# Altium schematic sheet Main Diagram.SchDoc: Main Diagram
size Letter; Author: Alfredo Cortellini; Organization: IT Logic; Address1: 5753 Highway 85 N; Address2: Crestview, FL 32536; Address3: United States; DocumentNumber: 3; SheetNumber: 3; SheetTotal: 3; Email: pcb-design@itlogic.cloud
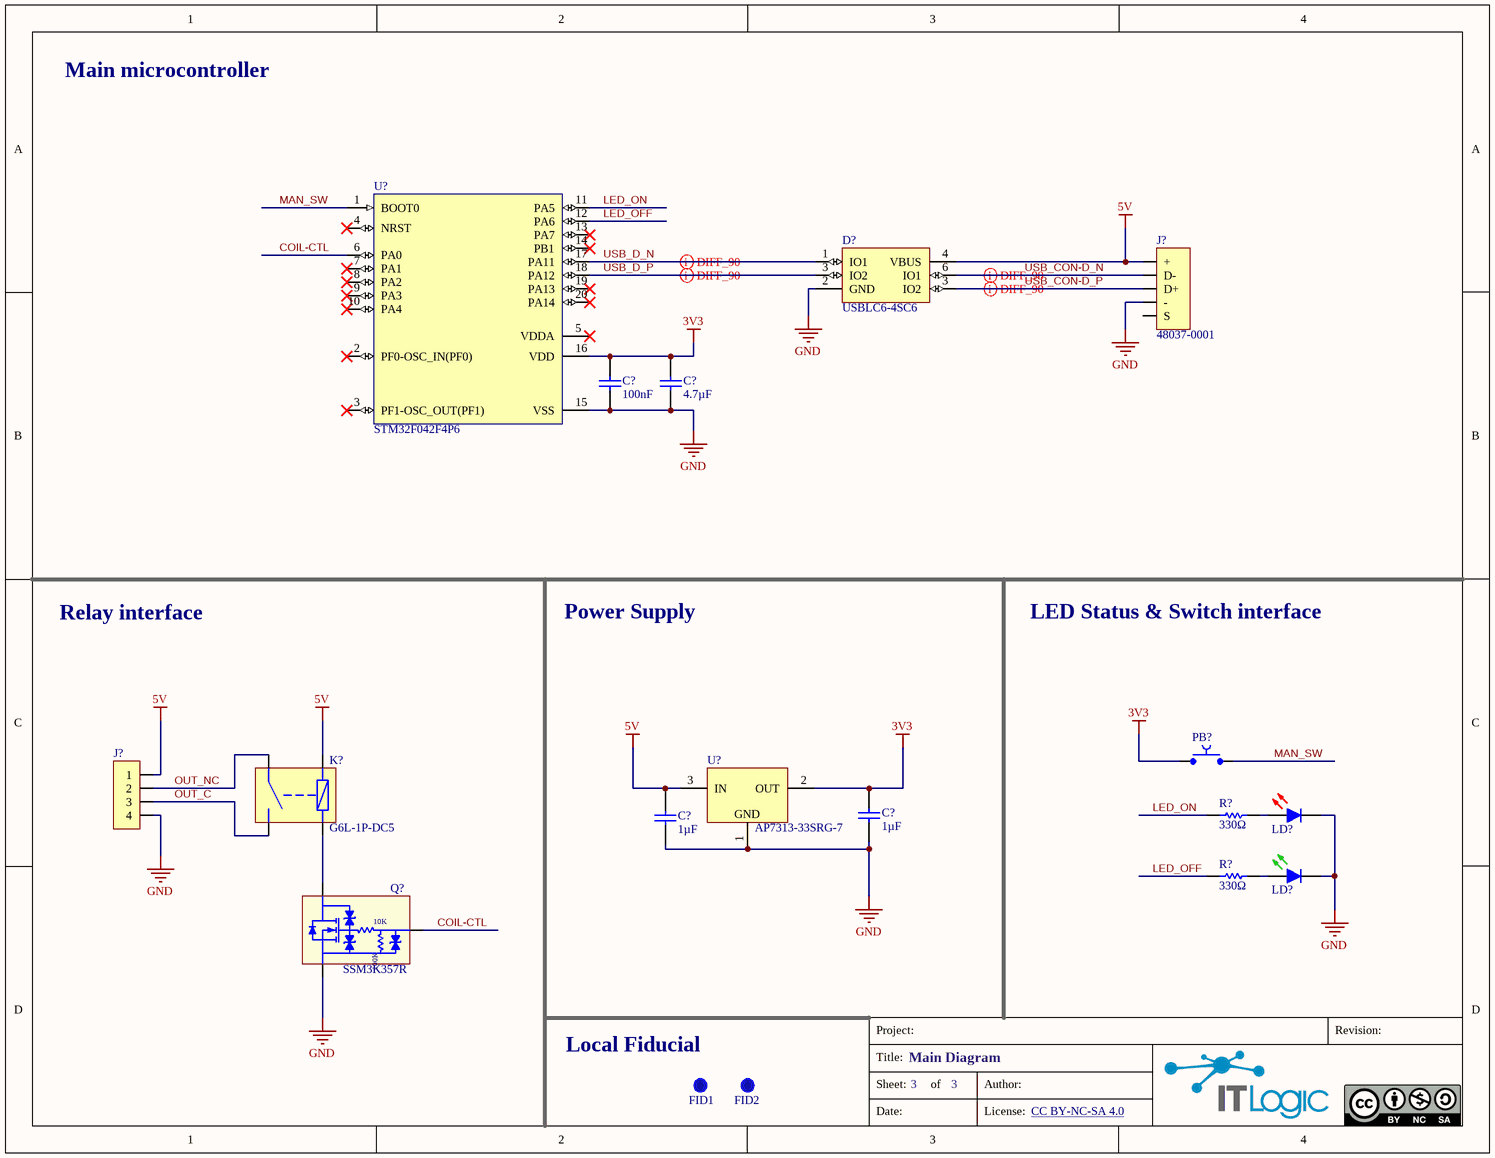
[diagram p0: Main Diagram.SchDoc]

## Parts
(Parts that share a designator on the sheet are numbered #1, #2 ... from top to bottom, then left to right.)
C?#1  100nF  [C0603-H90]
C?#2  4.7µF  [C0603-H90]
C?#3  1µF  [C0603-H90]
C?#4  1µF  [C0603-H90]
D?  USBLC6-4SC6  [SOT-236]
FID1  Local Fiducial  [FID-1-2MM]  (value not drawn)
FID2  Local Fiducial  [FID-1-2MM]  (value not drawn)
J?#1  48037-0001  [48037-0001]
J?#2  S4B-XH-A(LF)(SN)  [JST S4B-XH-A]  (value not drawn)
K?  G6L-1P-DC5  [G6L-1P]
LD?#1  LTST-S220KRKT  [LED-0805-R-SIDE]  (value not drawn)
LD?#2  LTST-S220KGKT  [LED-0805-G-SIDE]  (value not drawn)
PB?  TL3302AF180QJ  [TL3302AFXXXQJ]  (value not drawn)
Q?  SSM3K357R  [SOT-23]
R?#1  330Ω  [R0603-H55]
R?#2  330Ω  [R0603-H55]
U?#1  STM32F042F4P6  [TSSOP-20]
U?#2  AP7313-33SRG-7  [SOT-23]

## Nets
3V3: C?#1.2 C?#2.2 C?#4.2 PB?.1 U?#1.16(VDD) U?#2.2(OUT)
5V: C?#3.2 D?.4(VBUS) J?#1.1(+) J?#2.1 K?.8 U?#2.3(IN)
GND: C?#1.1 C?#2.1 C?#3.1 C?#4.1 D?.2(GND) J?#1.4(-) J?#2.4 LD?#1.1(K) LD?#2.1(K) Q?.2(S) U?#1.15(VSS) U?#2.1(GND)
COIL-CTL: Q?.1(G) U?#1.6(PA0)
LED_OFF: R?#2.1 U?#1.12(PA6)
LED_ON: R?#1.1 U?#1.11(PA5)
MAN_SW: PB?.2 U?#1.1(BOOT0)
OUT_C: J?#2.3 K?.4(NO)
OUT_NC: J?#2.2 K?.2(C)
USB_CON-D_N: D?.6(IO1) J?#1.2(D-)
USB_CON-D_P: D?.3(IO2) J?#1.3(D+)
USB_D_N: D?.1(IO1) U?#1.17(PA11)
USB_D_P: D?.3(IO2) U?#1.18(PA12)
NetK?_5: K?.5 Q?.3(D)
NetLD?#1_2: LD?#1.2(A) R?#1.2
NetLD?#2_2: LD?#2.2(A) R?#2.2

Not connected (* = marked no-connect by the designer): J?#1 S; U?#1 2(PF0-OSC_IN(PF0))* 3(PF1-OSC_OUT(PF1))* 4(NRST)* 5(VDDA)* 7(PA1)* 8(PA2)* 9(PA3)* 10(PA4)* 13(PA7)* 14(PB1)* 19(PA13)* 20(PA14)*

## Layout directives
differential pair: USB_CON-D_N, USB_CON-D_P, USB_D_N, USB_D_P

## Notes on the sheet
- Main microcontroller
- Relay interface
- Power Supply
- LED Status & Switch interface
- Local Fiducial
- Project:
- Revision:
- Title:
- Sheet:
- of
- Author:
- Date:
- License:
- CC BY-NC-SA 4.0 <https://creativecommons.org/licenses/by-nc-sa/4.0/>
- (in symbol SSM3K357R) 10K; 100K

## Library data of the parts
C?#1 = CGA3E2X7R1H104K080AA: Cap 0603 Case Ceramic 100nF 50V X7R; Manufacturer: TDK; Value: 100n; Manufacturer Part Number: CGA3E2X7R1H104K080AA; Mount: Surface Mount; Case: 0603; Capacitance: 100nF; Dielectric: X7R; Voltage Rating: 50V; ComponentLink1URL: https://product.tdk.com/system/files/dam/doc/product/capacitor/ceramic/mlcc/catalog/mlcc_commercial_general_en.pdf; ComponentLink1Description: Data Sheet
C?#2 = GRM188Z71C475KE21D: Cap 0603 Case Ceramic 4.7uF 16V X7R; Manufacturer: Murata; Value: 4.7u; Manufacturer Part Number: GRM188Z71C475KE21D; Mount: Surface Mount; Case: 0603; ComponentLink1URL: https://www.murata.com/en-eu/products/productdetail?partno=GRM188Z71C475KE21%23; ComponentLink1Description: Data Sheet; Capacitance: 4.7uF; Dielectric: X7R; Voltage Rating: 16V
C?#3 C?#4 = C1608X7R1C105K080AC: Cap 0603 Case Ceramic 1uF 16V X7R; Manufacturer: TDK; Value: 1u; Manufacturer Part Number: C1608X7R1C105K080AC; Mount: Surface Mount; Case: 0603; Capacitance: 1uF; Dielectric: X7R; Voltage Rating: 16V; ComponentLink1URL: https://www.murata.com/en-eu/products/productdetail?partno=GRM188Z71C475KE21%23; ComponentLink1Description: Data Sheet
D? = USBLC6-4SC6: ESD Protection Diodes / TVS Diodes 2 Line 2.5pF USB 2.0 ESD Protect SOT23-6; Manufacturer: STMicroelectronics; Manufacturer Part Number: USBLC6-4SC6; Mount: Surface Mount; ComponentLink1URL: https://www.mouser.it/datasheet/2/389/usblc6_2-1852789.pdf; ComponentLink1Description: Data Sheet; Case: STO23-6
FID1 FID2 = FID-1-2MM: Fiducial 1.0mm Diameter, 2.0mmil Mask
J?#1 = 48037-0001: Conn USB type A plug 4 pin Horizontal TH; Manufacturer: Molex; Voltage Rating: 30V; Current Rating: 1.5A; Manufacturer Part Number: 48037-0001; Mount: Through Hole; ComponentLink1URL: https://www.molex.com/en-us/products/part-detail/480370001; ComponentLink1Description: Data Sheet
J?#2 = S4B-XH-A(LF)(SN): Conn Shrouded, Series JST XH, 4 Pos Header,(2.50mm) Through Hole, Right Angle Tin; Current Rating: 3A; Voltage Rating: 250V; Manufacturer: JST; Manufacturer Part Number: S4B-XH-A(LF)(SN); Mount: Through Hole; ComponentLink1URL: https://datasheet.ciiva.com/726/exh-726400.pdf; ComponentLink1Description: Data Sheet
K? = G6L-1P-DC5: Relay Low Signal Sealed SPST-NO 1A 5VDC Through Hole Tube; Manufacturer: Omron; Manufacturer Part Number: G6L-1P-DC5; ComponentLink1URL: http://www.farnell.com/datasheets/1846831.pdf; ComponentLink1Description: Data Sheet; Mount: Through Hole
LD?#1 = LTST-S220KRKT: LED 0805 Side Red 631nm 2-Pin; Manufacturer: Vishay Lite-On; Manufacturer Part Number: LTST-S220KRKT; Mount: Surface Mount; Case: 0805; ComponentLink1URL: https://www.mouser.com/datasheet/2/239/Lite-On-LTST-S220KRKT-1175337.pdf; ComponentLink1Description: Data Sheet
LD?#2 = LTST-S220KGKT: LED 0805 Side Green 569nm 2-Pin; Manufacturer: Vishay Lite-On; Manufacturer Part Number: LTST-S220KGKT; Mount: Surface Mount; Case: 0805; ComponentLink1URL: https://www.tme.eu/Document/34ab2c4b8c99e859d5012ee3f8356040/LTST-S220GKT.pdf; ComponentLink1Description: Data Sheet
PB? = TL3302AF180QJ: Tactile Switch Rectangular 6.00x3.55mm. Height 4.3mm. J-Lead 50mA 12VDC 180gf SMD; Manufacturer: E-Switch; Voltage Rating: 12V; Manufacturer Part Number: TL3302AF180QJ; Mount: Through Hole; Current Rating: 50 mA; ComponentLink1URL: https://sten-eswitch-13110800-production.s3.amazonaws.com/system/asset/product_line/data_sheet/159/TL3302.pdf; ComponentLink1Description: Data Sheet
Q? = SSM3K357R: Mosfet N 60V Vds 12V Vgs  RDSon1.2R for Inductive Load SOT-23; Manufacturer: Toshiba; Manufacturer Part Number: SSM3K357R; Mount: Surface Mount; Case: SOT-23; ComponentLink1Description: Data Sheet; ComponentLink1URL: https://toshiba.semicon-storage.com/info/SSM3K357R_datasheet_en_20210107.pdf?did=59207&prodName=SSM3K357R
R?#1 R?#2 = RC0603FR-07330RL: Resistor 0603 Case 330R 1% 1/10W; Manufacturer: Yageo; Voltage Rating: 150V; Value: 330; Manufacturer Part Number: RC0603FR-07330RL; Case: 0603; Resistance: 330R; ComponentLink1URL: https://datasheet.ciiva.com/11808/0900766b8106beab-11808155.pdf; ComponentLink1Description: Data Sheet; Mount: Surface Mount
U?#1 = STM32F042F4P6: STM32 Arm Cortex-M0 USB line MCU 16 Kbytes of Flash 48 MHz CPU USB CAN CEC; Manufacturer: STMicroelectronics; Frequency: 48 MHz; Manufacturer Part Number: STM32F042F4P6; Mount: Surface Mount; ComponentLink2URL: https://www.st.com/resource/en/datasheet/stm32f042f4.pdf; ComponentLink2Description: DataSheet; Case: TSSOP-20
U?#2 = AP7313-33SRG-7: LDO 3.3V 150mA Out  6Vin 130mV Dropout, Quiescent current 65uA Startup 80µs SOT-23; Manufacturer: Diodes; Manufacturer Part Number: AP7313-33SRG-7; ComponentLink1Description: Data Sheet; ComponentLink1URL: https://www.diodes.com/assets/Datasheets/AP7313.pdf; Mount: Surface Mount; Case: SOT-223